# EAGLE design writer (EAGLE 9.6.2)
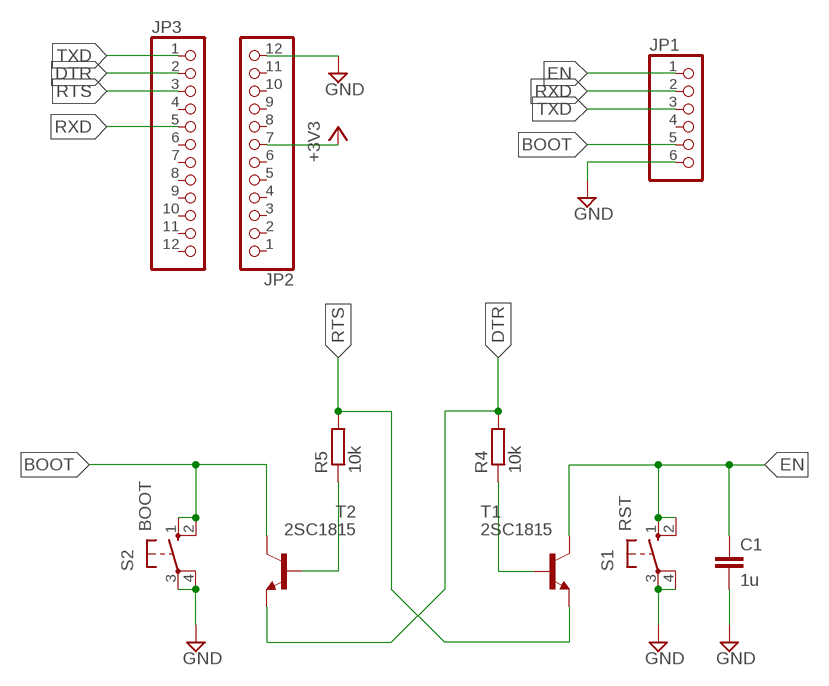
[diagram p0: schematic, sheet 1]

## Parts
C1  1u  C-EU050-025X075  [C050-025X075]
JP1  PINHD-1X6  [1X06]
JP2  PINHD-1X12  [1X12]
JP3  PINHD-1X12  [1X12]
R4  10k  R-EU_0207/10  [0207/10]
R5  10k  R-EU_0207/10  [0207/10]
S1  RST  10-XX  [B3F-10XX]
S2  BOOT  10-XX  [B3F-10XX]
T1  2SC1815  [TO92-ECB]
T2  2SC1815  [TO92-ECB]

## Nets
+3V3: JP2.7
BOOT: JP1.5 S2.1(S) S2.2(S1) T2.C
DTR: JP3.2 R4.2 T2.E
EN: C1.1 JP1.1 S1.1(S) S1.2(S1) T1.C
GND: C1.2 JP1.6 JP2.12 S1.3(P) S1.4(P1) S2.3(P) S2.4(P1)
N$4: R5.1 T2.B
N$5: R4.1 T1.B
RTS: JP3.3 R5.2 T1.E
RXD: JP1.2 JP3.5
TXD: JP1.3 JP3.1
Unconnected: JP1.4 JP2.1 JP2.2 JP2.3 JP2.4 JP2.5 JP2.6 JP2.8 JP2.9 JP2.10 JP2.11 JP3.4 JP3.6 JP3.7 JP3.8 JP3.9 JP3.10 JP3.11 JP3.12

## Library data of the parts
C1 = rcl:C-EU: CAPACITOR, European symbol; SPICEPREFIX: C
JP1 = pinhead:PINHD-1X6: PIN HEADER
JP2 JP3 = pinhead:PINHD-1X12: PIN HEADER
R4 R5 = rcl:R-EU_: RESISTOR, European symbol; SPICEPREFIX: R
S1 S2 = switch-omron:10-XX: OMRON SWITCH; MPN: B3F-1000; OC_FARNELL: 176432; OC_NEWARK: 36M3542
T1 T2 = transistor:2SC1815: NPN EPITAXIAL TRANSISTOR Source: TOSHIBA .. 2SC1815 1.pdf

## Board
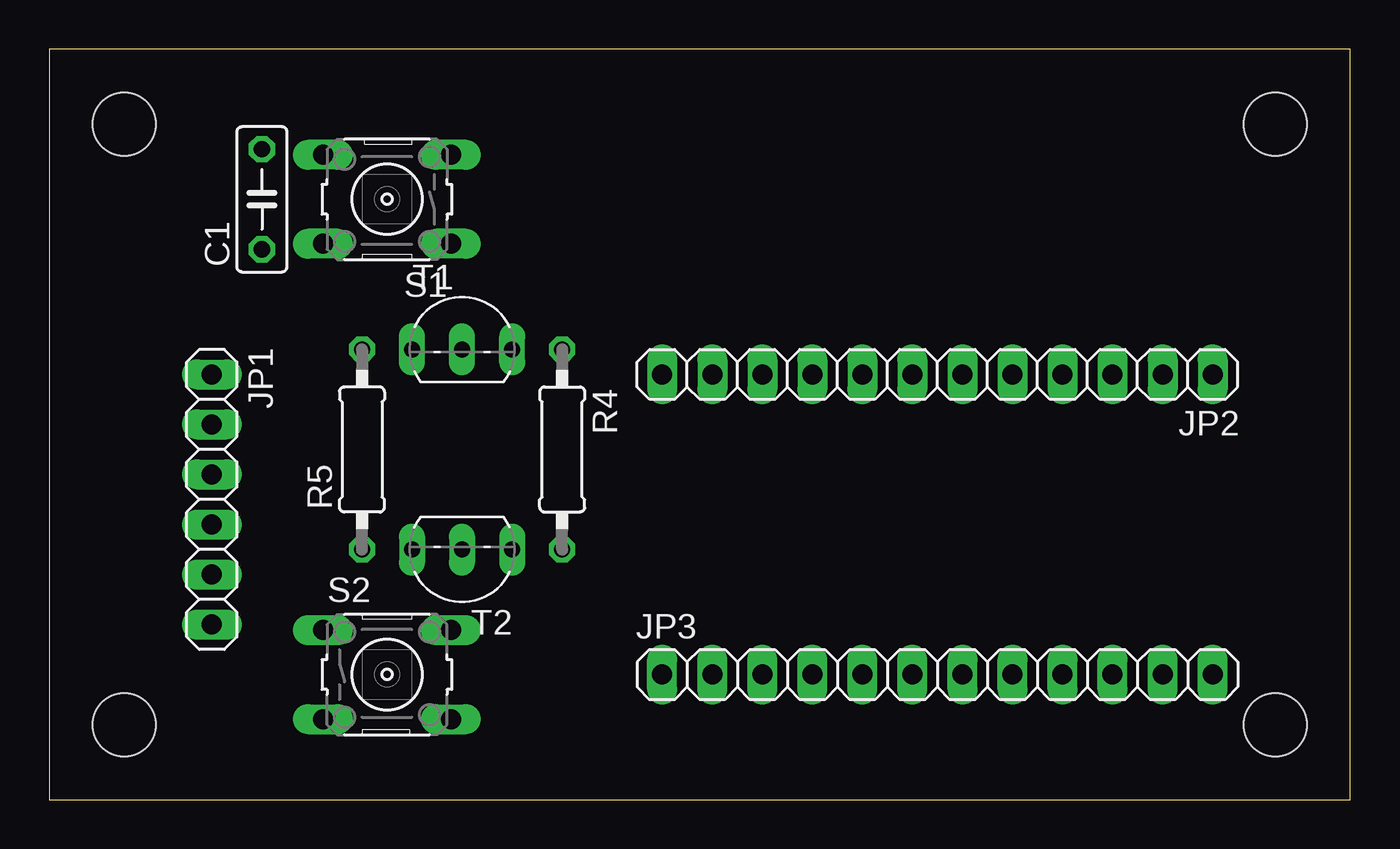
[diagram p1: board, top side]
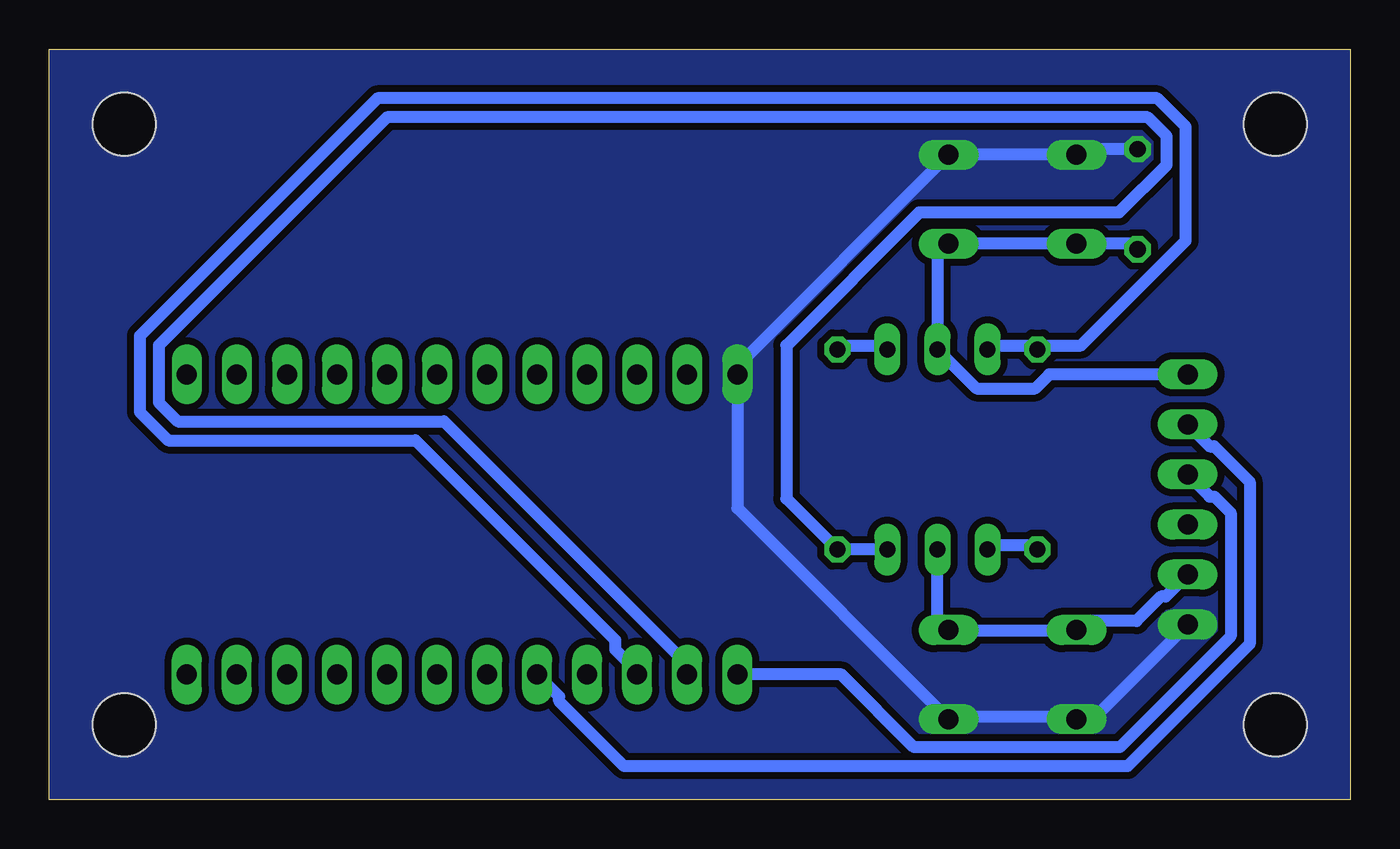
[diagram p2: board, bottom side, seen from below]

Size 66.04 x 38.1 mm. Coordinates in mm from the lower left corner, seen from the top.
Outline: 0,0 66.04,0 66.04,38.1 0,38.1 0,0
Copper layers (1*16): Top 0.035mm / dielectric 1.5mm / Bottom 0.035mm
Design rules "default *": minimum track width 24mil, minimum drill 0.6mm, track to track 14mil, track to pad 14mil, pad to pad 14mil, via to via 14mil, smd to smd 6mil, copper to edge 0mil, drill to drill 6mil, minimum pad ring 10mil, minimum via ring 8mil, stop-mask expansion 4mil, vias tented up to drill 0mil, thermal gap 10mil
Holes 3.2 mm at 62.23,3.81 62.23,34.29 3.81,34.29 3.81,3.81

### Footprints (pad centres in the part's own frame; a part is rotated, then mirrored left to right if it is on the bottom)
C050-025X075 = drill 0.813 octagon: 1 -2.54,0; 2 2.54,0
1X06 = drill 1.016 long: 1 -6.35,0; 2 -3.81,0; 3 -1.27,0; 4 1.27,0; 5 3.81,0; 6 6.35,0
1X12 = drill 1.016 long: 1 -13.97,0; 2 -11.43,0; 3 -8.89,0; 4 -6.35,0; 5 -3.81,0; 6 -1.27,0; 7 1.27,0; 8 3.81,0; 9 6.35,0; 10 8.89,0; 11 11.43,0; 12 13.97,0
0207/10 = drill 0.813 octagon: 1 -5.08,0; 2 5.08,0
B3F-10XX = drill 1.016 long: 1 -3.251,2.261; 2 3.251,2.261; 3 -3.251,-2.261; 4 3.251,-2.261
TO92-ECB = drill 0.813 long: B 2.54,0; C 0,0; E -2.54,0

### Placement (x,y rotation side)
C1  10.79,30.48 90 top
JP1  8.26,15.24 270 top
JP2  45.09,21.59 180 top
JP3  45.09,6.35 0 top
R4  26.04,17.78 270 top
R5  15.88,17.78 90 top
S1  17.14,30.48 180 top
S2  17.14,6.35 0 top
T1  20.95,22.86 0 top
T2  20.95,12.7 180 top

### Tracks (layer width: path | path; a pad name or v marks a point on that pad's centre or on a via)
BOOT
  Bottom 0.61: JP1.5 9.37,10.31 9.61,10.31 10.85,9.07 13.66,9.07 S2.1 14.15,8.59 19.94,8.59 S2.2 20.95,9.17 T2.C
DTR
  Bottom 0.61: JP3.2 33.93,6.66 33.93,7.14 46,19.2 59.51,19.2 60.48,20.17 60.48,23.06 48.9,34.65 10.29,34.65 9.32,33.68 9.32,32.23 11.73,29.82 21.87,29.82 28.63,23.06 28.63,15.29 R4.2 T2.E
EN
  Bottom 0.61: JP1.1 15.28,21.59 15.99,20.88 18.97,20.88 T1.C | T1.C 20.97,22.86 | C1.1 11.07,28.22 S1.2 S1.1 20.95,27.66 T1.C
GND
  Bottom 0.61: S2.4 19.94,4.24 14.15,4.24 S2.3 13.06,4.09 JP1.6 | 20.42,4.24 S2.4 | C1.2 13.61,33.02 S1.4 S1.3 31.11,22.02 JP2.12 31.11,14.81 S2.4
  pour Bottom (no thermals): 0,38.1 66.04,38.1 66.04,0 0,0
N$4
  Bottom 0.61: R5.1 16.08,12.93 18.01,12.93 T2.B
N$5
  Bottom 0.61: T1.B 23.8,23.06 25.73,23.06 R4.1
RTS
  Bottom 0.61: T1.E 18.01,23.06 16.08,23.06 R5.2 15.6,23.06 13.66,23.06 8.36,28.37 8.36,34.16 9.8,35.61 49.38,35.61 61.44,23.55 61.44,19.68 59.99,18.24 47.45,18.24 37.31,8.1 37.31,7.62 36.35,6.66 JP3.3
RXD
  Bottom 0.61: JP1.2 7.14,17.93 6.9,17.93 5.11,16.13 5.11,7.9 11.3,1.7 36.86,1.7 40.16,5 40.16,5.23 JP3.5
TXD
  Bottom 0.61: JP3.1 25.82,6.35 22.14,2.67 11.7,2.67 6.07,8.3 6.07,14.56 6.9,15.39 7.14,15.39 JP1.3